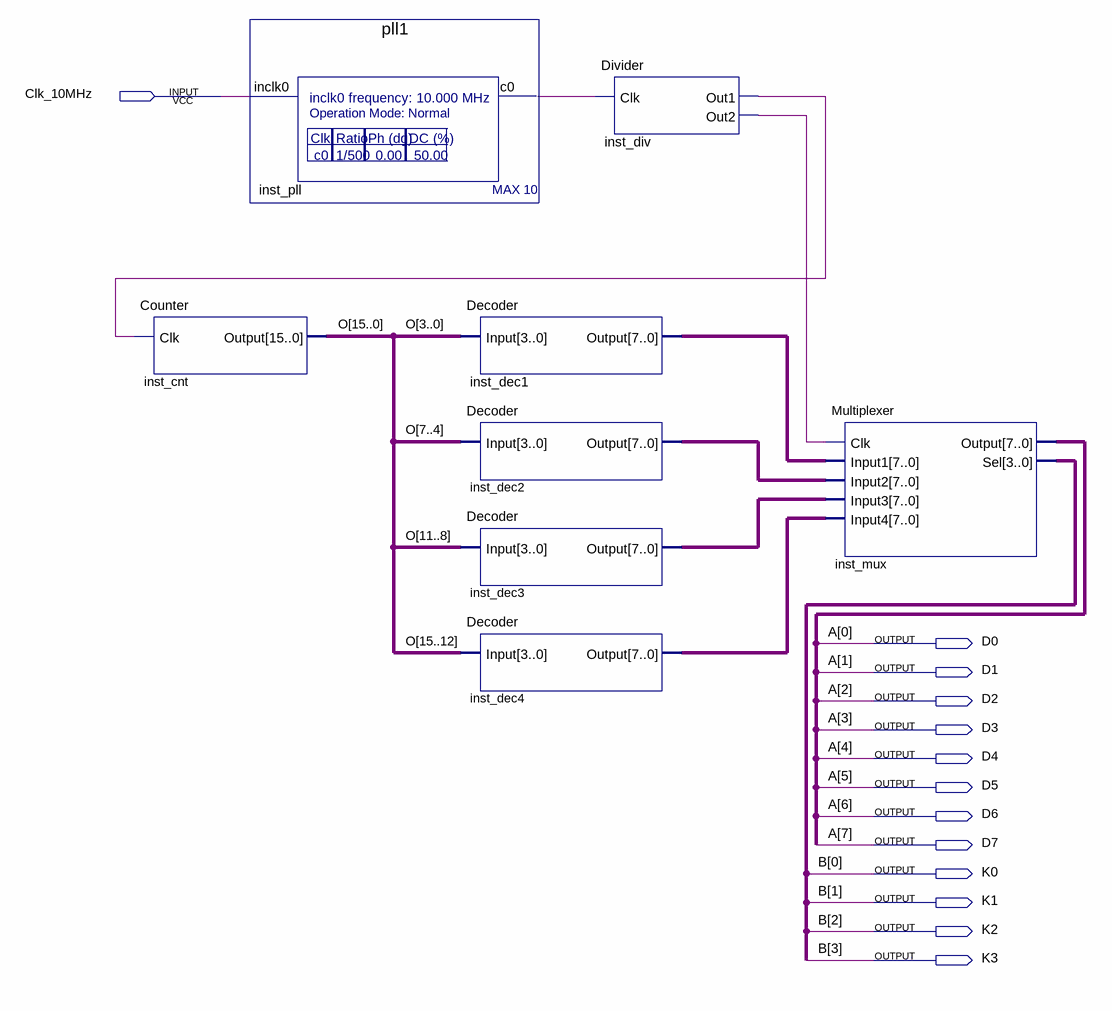
[diagram p0: schematic sheet]
// Quartus schematic 02-Display_Counter_VHDL.bdf as structural Verilog: 8 symbols, 13 pins
module \02-Display_Counter_VHDL  (
  input  Clk_10MHz,
  output D0,
  output D1,
  output D2,
  output D3,
  output D4,
  output D5,
  output D6,
  output D7,
  output K0,
  output K1,
  output K2,
  output K3
);

  wire inst_div_out1, inst_div_out2, inst_pll_c0;
  wire [7:0] inst_dec1_output, inst_dec2_output, inst_dec3_output, inst_dec4_output;
  wire [15:0] O;

  Counter inst_cnt (.Clk(inst_div_out1), .Output(O));
  pll1 inst_pll (.inclk0(Clk_10MHz), .c0(inst_pll_c0));
  Decoder inst_dec1 (.Input(O[3:0]), .Output(inst_dec1_output));
  Decoder inst_dec2 (.Input(O[7:4]), .Output(inst_dec2_output));
  Decoder inst_dec3 (.Input(O[11:8]), .Output(inst_dec3_output));
  Decoder inst_dec4 (.Input(O[15:12]), .Output(inst_dec4_output));
  Divider inst_div (.Clk(inst_pll_c0), .Out1(inst_div_out1), .Out2(inst_div_out2));
  Multiplexer inst_mux (
    .Clk(inst_div_out2), .Input1(inst_dec1_output), .Input2(inst_dec2_output), .Input3(inst_dec3_output),
    .Input4(inst_dec4_output), .Output({D7, D6, D5, D4, D3, D2, D1, D0}), .Sel({K3, K2, K1, K0}));

  // Other names for the same wires on the sheet: A[7:0] = {D7, D6, D5, D4, D3, D2, D1, D0}; B[3:0] = {K3, K2, K1, K0}
endmodule
